# EAGLE design lcdboardsch (EAGLE 4.16)
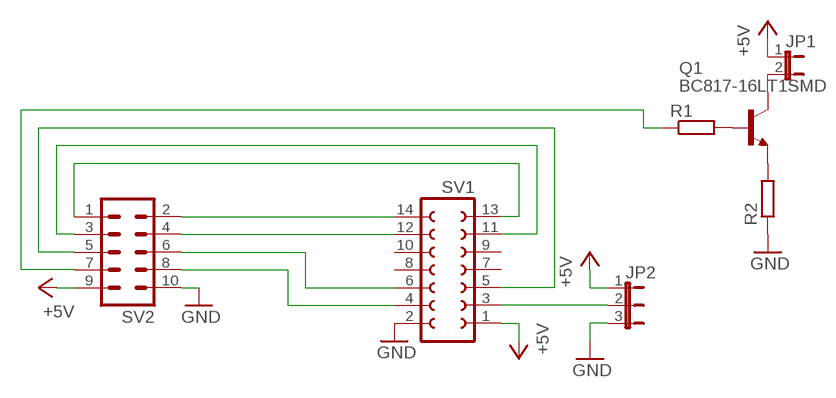
[diagram p0: schematic, sheet 1]

## Parts
JP1  JP1E  [JP1]
JP2  JP2E  [JP2]
Q1  BC817-16LT1SMD  [SOT23-BEC]
R1  R-EU_M0805  [M0805]
R2  R-EU_M0805  [M0805]
SV1  FE07-2  [FE07-2]
SV2  MA05-2  [MA05-2]

## Nets
+5V: JP1.1 JP2.1 SV1.1 SV2.9
GND: JP2.3 R2.1 SV1.2 SV2.10
N$1: SV1.14 SV2.2
N$2: SV1.12 SV2.4
N$3: SV1.6 SV2.6
N$4: SV1.4 SV2.8
N$5: SV1.13 SV2.1
N$6: SV1.11 SV2.3
N$7: SV1.5 SV2.5
N$8: R1.1 SV2.7
N$9: Q1.B R1.2
N$10: Q1.E R2.2
N$11: JP1.2 Q1.C
N$14: JP2.2 SV1.3
Unconnected: SV1.7 SV1.8 SV1.9 SV1.10

## Library data of the parts
JP1 = jumper:JP1E: JUMPER
JP2 = jumper:JP2E: JUMPER
Q1 = transistor-npn:BC817*: NPN Transistor
R1 R2 = rcl:R-EU_: RESISTOR, European symbol
SV1 = con-lsta:FE07-2: FEMALE HEADER
SV2 = con-lstb:MA05-2: PIN HEADER

## Board
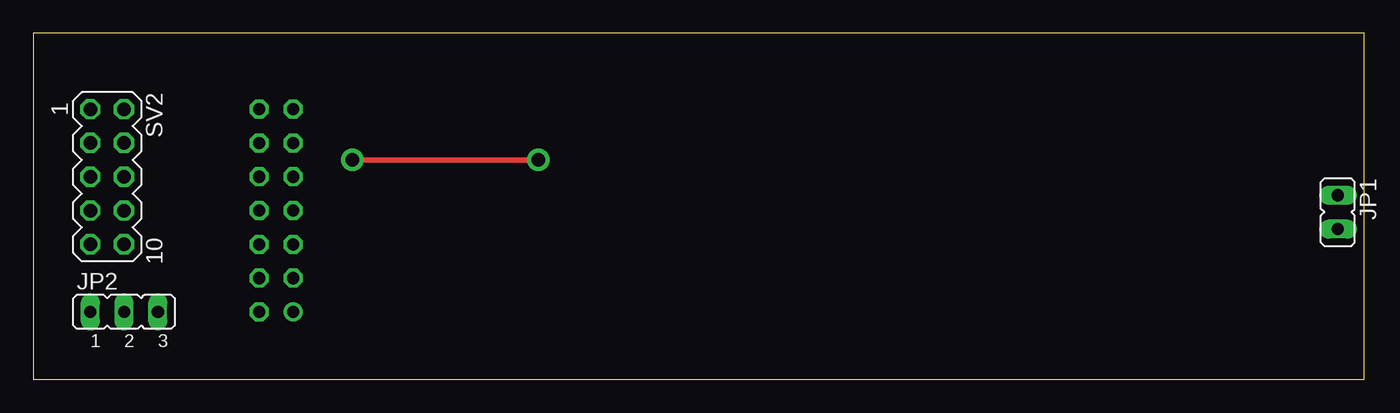
[diagram p1: board, top side]
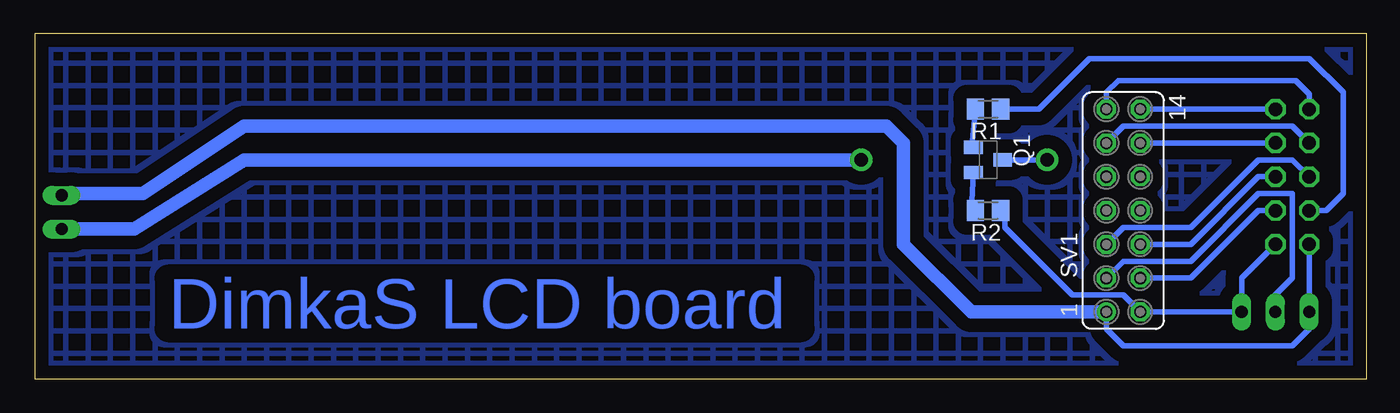
[diagram p2: board, bottom side, seen from below]

Size 100 x 26.03 mm. Coordinates in mm from the lower left corner, seen from the top.
Outline: 0,0 100,0 100,26.03 0,26.03 0,0
Copper layers (1*16): Top 0.035mm / dielectric 1.5mm / Bottom 0.035mm
Design rules "dimka": minimum track width 10mil, minimum drill 24mil, track to track 10mil, track to pad 10mil, pad to pad 10mil, via to via 10mil, smd to smd 10mil, copper to edge 40mil, drill to drill 10mil, minimum pad ring 10mil, minimum via ring 8mil, stop-mask expansion 4mil, vias tented up to drill 0mil, thermal gap 10mil

### Footprints (pad centres in the part's own frame; a part is rotated, then mirrored left to right if it is on the bottom)
JP1 = drill 0.914 long: 1 0,-1.27; 2 0,1.27
JP2 = drill 0.914 long: 1 -2.54,0; 2 0,0; 3 2.54,0
SOT23-BEC = smd 1 x 1.4: B -0.95,-1.1; C 0,1.1; E 0.95,-1.1
M0805 = smd 1.3 x 1.6: 1 -0.95,0; 2 0.95,0
FE07-2 = drill 0.914 round: 1 -7.62,1.27 | drill 0.914 octagon: 2 -7.62,-1.27; 3 -5.08,1.27; 4 -5.08,-1.27; 5 -2.54,1.27; 6 -2.54,-1.27; 7 0,1.27; 8 0,-1.27; 9 2.54,1.27; 10 2.54,-1.27; 11 5.08,1.27; 12 5.08,-1.27; 13 7.62,1.27; 14 7.62,-1.27
MA05-2 = drill 1.016 octagon: 1 -5.08,-1.27; 2 -5.08,1.27; 3 -2.54,-1.27; 4 -2.54,1.27; 5 0,-1.27; 6 0,1.27; 7 2.54,-1.27; 8 2.54,1.27; 9 5.08,-1.27; 10 5.08,1.27

### Placement (x,y rotation side)
JP1  98.01,12.57 180 top
JP2  6.82,5.08 0 top
Q1  28.41,16.5 270 bottom
R1  28.41,20.31 180 bottom
R2  28.41,12.7 180 bottom
SV1  18.25,12.7 90 bottom
SV2  5.55,15.23 270 top

### Tracks (layer width: path | path; a pad name or v marks a point on that pad's centre or on a via)
+5V
  Bottom 0.406: SV2.9 JP2.1 4.28,3.8 5.55,2.54 18.25,2.54 19.52,3.8 SV1.1
  Bottom 1.016: SV1.1 29.68,5.08 34.76,10.16 34.76,17.78 36.03,19.05 84.29,19.05 91.91,13.97 98.26,13.97 JP1.1
GND
  Bottom 0.406: SV2.10 9.36,7.62 JP2.3 SV1.2 18.25,6.34 22.06,6.34 27.14,11.42 27.14,12.7 R2.1
N$1
  Bottom 0.406: SV2.2 SV1.14
N$2
  Bottom 0.406: SV2.4 SV1.12
N$3
  Bottom 0.406: SV2.6 8.09,15.23 13.17,10.16 SV1.6
N$4
  Bottom 0.406: SV2.8 8.09,12.7 13.17,7.62 SV1.4
N$5
  Bottom 0.406: SV2.1 4.28,21.46 5.3,22.47 18.63,22.47 19.52,21.59 19.52,20.44 19.39,20.31 SV1.13
N$6
  Bottom 0.406: SV2.3 5.55,19.05 18.25,19.05 SV1.11
N$7
  Bottom 0.406: SV2.5 5.55,16.5 8.09,16.5 13.17,11.42 18.25,11.42 SV1.5
N$8
  Bottom 0.406: SV2.7 3.01,12.7 1.74,13.97 1.74,21.59 4.28,24.12 20.79,24.12 24.6,20.31 R1.1
N$9
  Bottom 0.406: Q1.B 29.3,17.39 | Q1.B 29.68,17.78 | Q1.B 29.68,17.14 R1.2
N$10
  Bottom 0.406: 29.43,15.62 Q1.E 29.68,12.7 R2.2
N$11  (via drill 1 pad 1.68)
  Top 0.406: v23.96,16.5 v37.94,16.5
  Bottom 0.406: v23.96,16.5 Q1.C | v37.94,16.5 41.11,16.5
  Bottom 1.016: JP1.2 92.55,11.3 84.29,16.5 v37.94,16.5
N$12
  pour Bottom (isolate 1.016, hatched): -0.17,26.03 -0.17,0 99.53,0 100.16,0 100.16,26.03
N$14
  Bottom 0.406: JP2.2 6.82,6.34 5.55,7.62 5.55,13.97 8.09,13.97 13.17,8.88 18.25,8.88 SV1.3

### Text on the board
Bottom: DimkaS LCD board